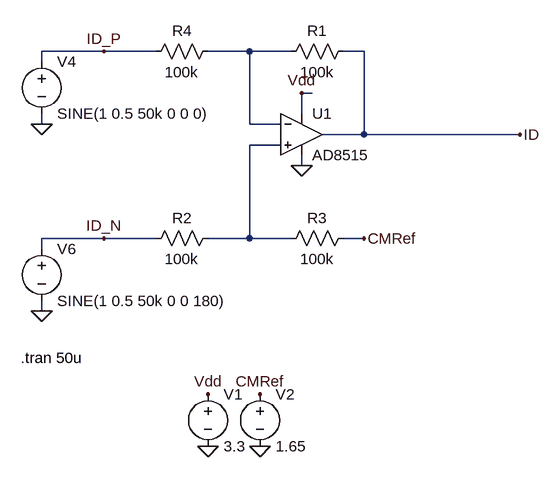
[diagram p0: schematic IQAmplifier.asc]
IQAmplifier.asc, the LTspice schematic file:
Version 4
SHEET 1 1016 680
WIRE -16 32 -112 32
WIRE 64 32 -16 32
WIRE 208 32 144 32
WIRE 272 32 208 32
WIRE 384 32 352 32
WIRE -112 48 -112 32
WIRE 304 96 288 96
WIRE 288 128 288 96
WIRE -112 144 -112 128
WIRE 208 144 208 32
WIRE 256 144 208 144
WIRE 384 160 384 32
WIRE 384 160 320 160
WIRE 624 160 384 160
WIRE 256 176 208 176
WIRE 288 208 288 192
WIRE -16 320 -112 320
WIRE 64 320 -16 320
WIRE 208 320 208 176
WIRE 208 320 144 320
WIRE 272 320 208 320
WIRE 384 320 352 320
WIRE -112 336 -112 320
WIRE -112 432 -112 416
FLAG 224 640 0
FLAG 144 640 0
FLAG 144 560 Vdd
FLAG 224 560 CMRef
FLAG -112 144 0
FLAG -112 432 0
FLAG 288 96 Vdd
FLAG 384 320 CMRef
FLAG 624 160 ID
FLAG -16 32 ID_P
FLAG -16 320 ID_N
FLAG 288 208 0
SYMBOL voltage 144 544 R0
WINDOW 123 0 0 Left 0
WINDOW 39 0 0 Left 0
SYMATTR InstName V1
SYMATTR Value 3.3
SYMBOL voltage 224 544 R0
WINDOW 123 0 0 Left 0
WINDOW 39 0 0 Left 0
SYMATTR InstName V2
SYMATTR Value 1.65
SYMBOL res 368 16 R90
WINDOW 0 0 56 VBottom 2
WINDOW 3 32 56 VTop 2
SYMATTR InstName R1
SYMATTR Value 100k
SYMBOL res 368 304 R90
WINDOW 0 0 56 VBottom 2
WINDOW 3 32 56 VTop 2
SYMATTR InstName R3
SYMATTR Value 100k
SYMBOL voltage -112 32 R0
WINDOW 123 0 0 Left 0
WINDOW 39 0 0 Left 0
SYMATTR InstName V4
SYMATTR Value SINE(1 0.5 50k 0 0 0)
SYMBOL voltage -112 320 R0
WINDOW 123 0 0 Left 0
WINDOW 39 0 0 Left 0
SYMATTR InstName V6
SYMATTR Value SINE(1 0.5 50k 0 0 180)
SYMBOL res 160 304 R90
WINDOW 0 0 56 VBottom 2
WINDOW 3 32 56 VTop 2
SYMATTR InstName R2
SYMATTR Value 100k
SYMBOL res 160 16 R90
WINDOW 0 0 56 VBottom 2
WINDOW 3 32 56 VTop 2
SYMATTR InstName R4
SYMATTR Value 100k
SYMBOL Opamps\\AD8515 288 96 R0
SYMATTR InstName U1
TEXT -144 504 Left 2 !.tran 50u

The netlist it stands for:
* IQAmplifier.asc
V1 Vdd 0 3.3
V2 CMRef 0 1.65
R1 ID N001 100k
R3 CMRef N002 100k
V4 ID_P 0 SINE(1 0.5 50k 0 0 0)
V6 ID_N 0 SINE(1 0.5 50k 0 0 180)
R2 N002 ID_N 100k
R4 N001 ID_P 100k
XU1 N002 N001 Vdd 0 ID AD8515  ; pins In+ In- V+ V- OUT
.tran 50u
.lib ADI.lib
.backanno
.end